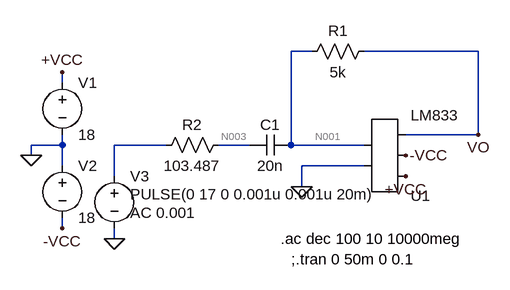
[diagram p0: schematic Derivador compensado.asc]
* Derivador compensado.asc
V1 +VCC 0 18
V2 0 -VCC 18
C1 N001 N003 20n
R1 VO N001 5k
* U1: LM833 (symbol AutoGenerated\LM833 not available, pins judged from their places): pin1=0 pin2=N001 pin3=+VCC pin4=-VCC pin5=VO
V3 N002 0 PULSE(0 17 0 0.001u 0.001u 20m) AC 0.001
R2 N003 N002 103.487
.ac dec 100 10 10000meg
;.tran 0 50m 0 0.1
.backanno
.end

* Results of the author's LTspice run, read from the files saved beside the schematic
* Operating Point, zero values left out:
*   V(+vcc) = 18 V
*   V(-vcc) = -18 V
*   V(n001) = 487 nV
*   V(vo) = -1.25 mV
*   I(R1) = -250 nA
*   I(V2) = -2.266 mA
*   I(V1) = -2.266 mA
*   Ix(u1:2) = -250 nA
*   Ix(u1:1) = -250 nA
*   Ix(u1:4) = 2.266 mA
*   Ix(u1:5) = -2.266 mA
*   Ix(u1:3) = 250 nA
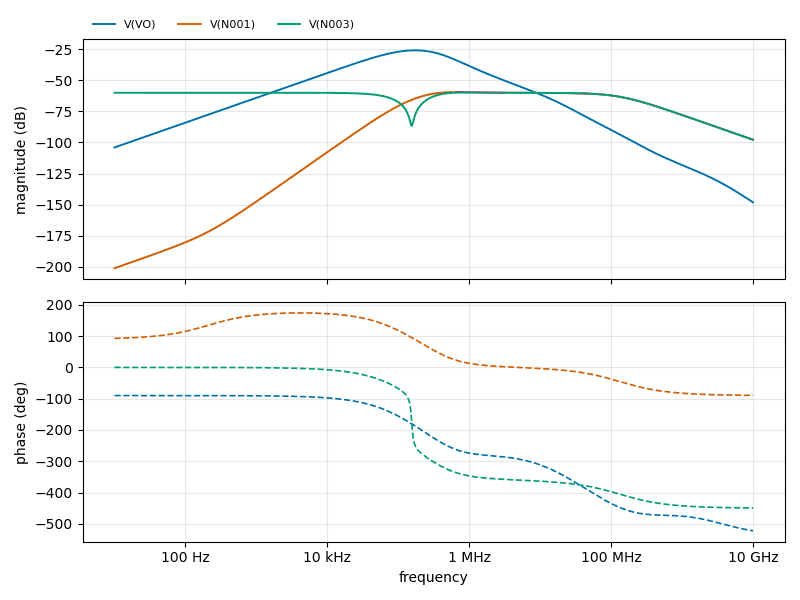
[diagram p1: AC Analysis of Derivador compensado.asc, plotted from the saved traces]
* AC Analysis, 1 run:
*   V(VO): -104.04 dB at 10 Hz, -148.25 dB at 10 GHz, peak -25.87 dB at 169.8 kHz, 3 dB below the peak at 68.55 kHz and 387.2 kHz
*   V(N001): -201.23 dB at 10 Hz, -97.85 dB at 10 GHz, peak -59.49 dB at 645.7 kHz, 3 dB below the peak at 226.5 kHz and 109.9 MHz
*   V(N003): -60.00 dB at 10 Hz, -97.84 dB at 10 GHz, peak -59.78 dB at 871 kHz, 3 dB below the peak at 319.3 kHz and 118.8 MHz